# EAGLE design 5i20-xylotex-d (EAGLE 5.06)
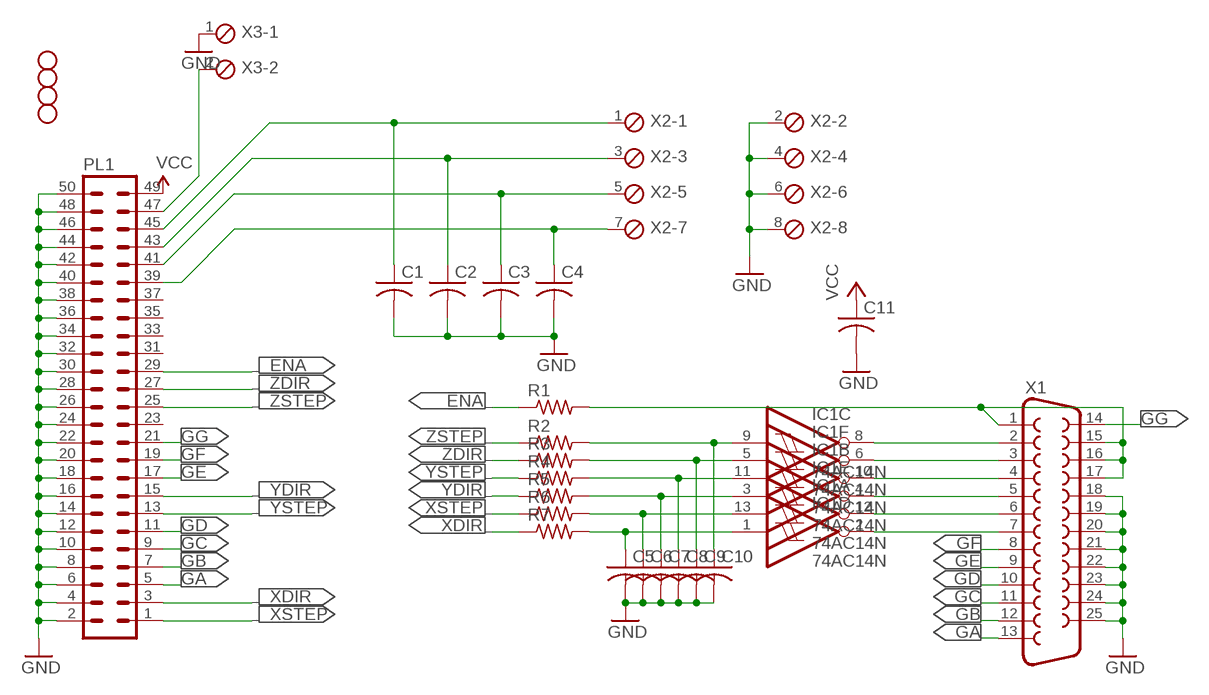
[diagram p0: schematic, sheet 1]

## Parts
C1  C-US025-025X050  [C025-025X050]
C2  C-US025-025X050  [C025-025X050]
C3  C-US025-025X050  [C025-025X050]
C4  C-US025-025X050  [C025-025X050]
C5  C-US025-024X044  [C025-024X044]
C6  C-US025-024X044  [C025-024X044]
C7  C-US025-024X044  [C025-024X044]
C8  C-US025-024X044  [C025-024X044]
C9  C-US025-024X044  [C025-024X044]
C10  C-US025-024X044  [C025-024X044]
C11  C-US025-024X044  [C025-024X044]
IC1  74AC14N  [DIL14]
PL1  50V  [50V]
R1  R-US_0204/2V  [0204V]
R2  R-US_0204/2V  [0204V]
R3  R-US_0204/2V  [0204V]
R4  R-US_0204/2V  [0204V]
R5  R-US_0204/2V  [0204V]
R6  R-US_0204/2V  [0204V]
R7  R-US_0204/2V  [0204V]
U$1  STAND-OFF  [STAND-OFF]
U$2  STAND-OFF  [STAND-OFF]
U$3  STAND-OFF  [STAND-OFF]
U$4  STAND-OFF  [STAND-OFF]
X1  F25HP  [F25HP]
X2  MPT8  [8POL254]
X3  MPT2  [2POL254]

## Nets
ENA: PL1.29 R1.1 R1.2 X1.1 X1.15 X1.16 X1.17
GA: PL1.5 X1.13
GB: PL1.7 X1.12
GC: PL1.9 X1.11
GD: PL1.11 X1.10
GE: PL1.17 X1.9
GF: PL1.19 X1.8
GG: PL1.21 X1.14
GND [pwr]: C1.2 C2.2 C3.2 C4.2 C5.2 C6.2 C7.2 C8.2 C9.2 C10.2 C11.2 PL1.2 PL1.4 PL1.6 PL1.8 PL1.10 PL1.12 PL1.14 PL1.16 PL1.18 PL1.20 PL1.22 PL1.24 PL1.26 PL1.28 PL1.30 PL1.32 PL1.34 PL1.36 PL1.38 PL1.40 PL1.42 PL1.44 PL1.46 PL1.48 PL1.50 X1.18 X1.19 X1.20 X1.21 X1.22 X1.23 X1.24 X1.25 X2.2 X2.4 X2.6 X2.8 X3.1
N$2: IC1.2(D:O) X1.7
N$3: IC1.12(A:O) X1.6
N$4: IC1.4(E:O) X1.5
N$6: IC1.10(B:O) X1.4
N$7: IC1.6(F:O) X1.3
N$8: IC1.8(C:O) X1.2
N$11: PL1.47 X3.2
TSW: C1.1 PL1.45 X2.1
VCC: C11.1 PL1.49
XDIR: PL1.3 R7.1
XDIRF: C5.1 IC1.1(D:I) R7.2
XSTEP: PL1.1 R6.1
XSTEPF: C6.1 IC1.13(A:I) R6.2
XSW: C4.1 PL1.39 X2.7
YDIR: PL1.15 R5.1
YDIRF: C7.1 IC1.3(E:I) R5.2
YSTEP: PL1.13 R4.1
YSTEPF: C8.1 IC1.11(B:I) R4.2
YSW: C3.1 PL1.41 X2.5
ZDIR: PL1.27 R3.1
ZDIRF: C9.1 IC1.5(F:I) R3.2
ZSTEP: PL1.25 R2.1
ZSTEPF: C10.1 IC1.9(C:I) R2.2
ZSW: C2.1 PL1.43 X2.3
Unconnected: PL1.23 PL1.31 PL1.33 PL1.35 PL1.37

## Power pins joined to a net without a drawn wire
GND: IC1.7(P:GND)
VCC: IC1.14(P:VCC)

## Library data of the parts
C1-C11 = rcl:C-US: CAPACITOR, American symbol
IC1 = 74xx-eu:74*14: Hex schmitt trigger INVERTER
PL1 = con-harting-v:50V: CONNECTOR
R1-R7 = rcl:R-US_: RESISTOR, American symbol
U$1-U$4 = SparkFun:STAND-OFF: Stand Off This is the mechanical footprint for a #4 phillips button head screw. Use the keepout ring to avoid running the screw head into surrounding components. SKU : PRT-00447
X1 = SparkFun:F25: D-SUB 25 25 Pin male connector. PCB edge mount for regular PCB thicknesses. This connector will connect directly to the back of a PC parallel port or through a normal DB25 extension cable (M/F). SKU: PRT-08287
X2 = con-phoenix-254:MPT8: PHOENIX CONNECTOR
X3 = con-phoenix-254:MPT2: PHOENIX CONNECTOR

## Net classes
0 default: width 0.356 mm, clearance 0.33 mm
1 pwr: width 0.635 mm

## Board
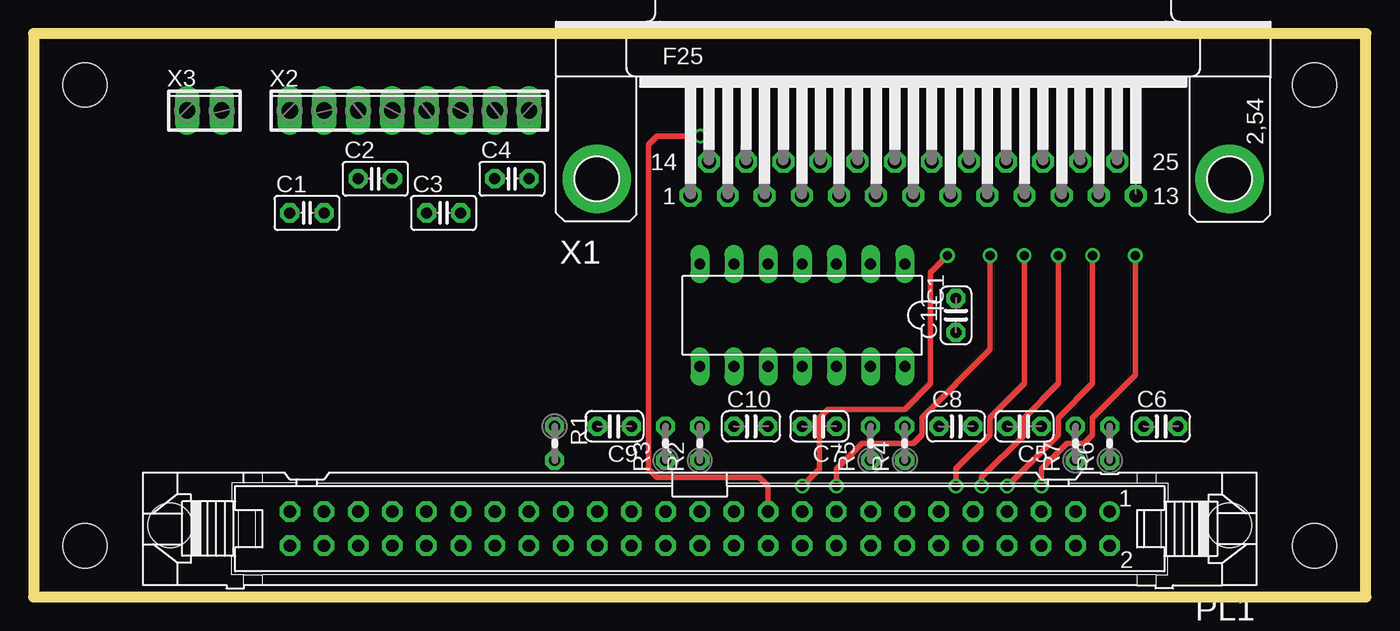
[diagram p1: board, top side]
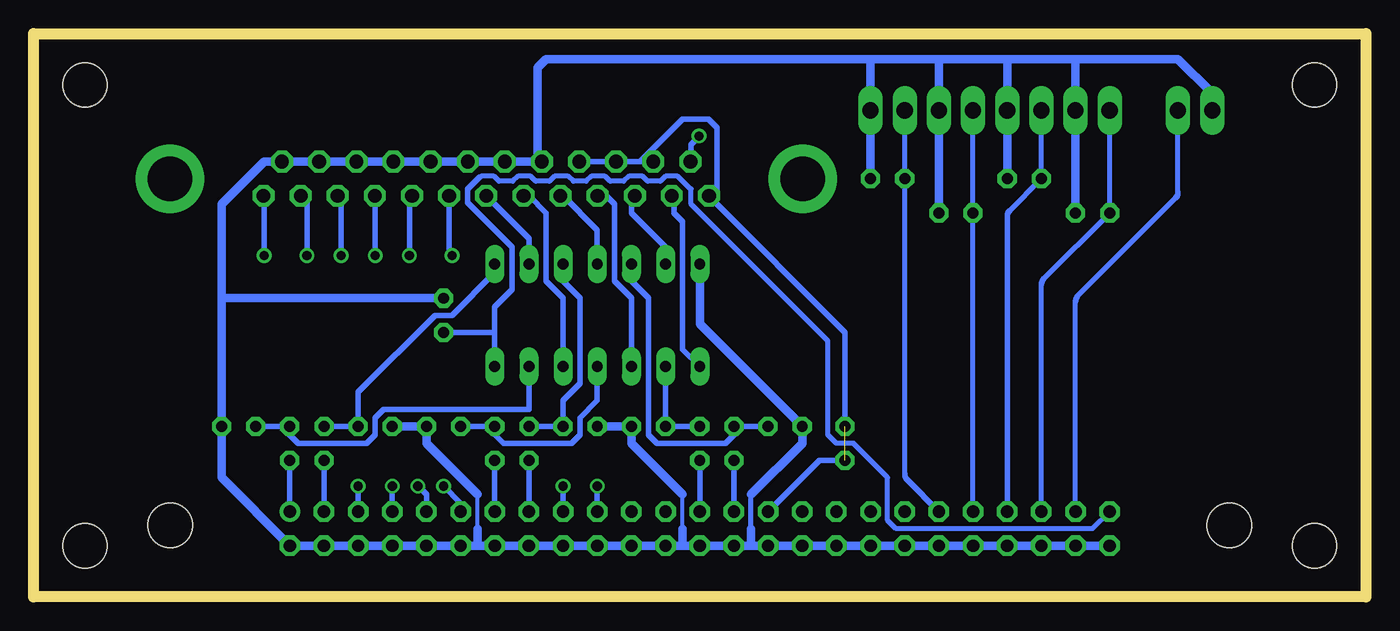
[diagram p2: board, bottom side, seen from below]

Size 99.06 x 41.91 mm. Coordinates in mm from the lower left corner, seen from the top.
Outline: 0,0 99.06,0 99.06,41.91 0,41.91 0,0
Copper layers (1*16): Top 0.035mm / dielectric 1.5mm / Bottom 0.035mm
Design rules "default *": minimum track width 10mil, minimum drill 27mil, track to track 8mil, track to pad 8mil, pad to pad 8mil, via to via 8mil, smd to smd 8mil, copper to edge 4mil, drill to drill 8mil, minimum pad ring 12mil, minimum via ring 8mil, stop-mask expansion 4mil, vias tented up to drill 0mil, thermal gap 10mil

### Footprints (pad centres in the part's own frame; a part is rotated, then mirrored left to right if it is on the bottom)
C025-025X050 = drill 0.813 octagon: 1 -1.27,0; 2 1.27,0
C025-024X044 = drill 0.813 octagon: 1 -1.27,0; 2 1.27,0
DIL14 = drill 0.813 long: 1 -7.62,-3.81; 2 -5.08,-3.81; 3 -2.54,-3.81; 4 0,-3.81; 5 2.54,-3.81; 6 5.08,-3.81; 7 7.62,-3.81; 8 7.62,3.81; 9 5.08,3.81; 10 2.54,3.81; 11 0,3.81; 12 -2.54,3.81; 13 -5.08,3.81; 14 -7.62,3.81
50V = drill 0.914 round: 1 -30.48,-1.27 | drill 0.914 octagon: 2 -30.48,1.27; 3 -27.94,-1.27; 4 -27.94,1.27; 5 -25.4,-1.27; 6 -25.4,1.27; 7 -22.86,-1.27; 8 -22.86,1.27; 9 -20.32,-1.27; 10 -20.32,1.27; 11 -17.78,-1.27; 12 -17.78,1.27; 13 -15.24,-1.27; 14 -15.24,1.27; 15 -12.7,-1.27; 16 -12.7,1.27; 17 -10.16,-1.27; 18 -10.16,1.27; 19 -7.62,-1.27; 20 -7.62,1.27; 21 -5.08,-1.27; 22 -5.08,1.27; 23 -2.54,-1.27; 24 -2.54,1.27; 25 0,-1.27; 26 0,1.27; 27 2.54,-1.27; 28 2.54,1.27; 29 5.08,-1.27; 30 5.08,1.27; 31 7.62,-1.27; 32 7.62,1.27; 33 10.16,-1.27; 34 10.16,1.27; 35 12.7,-1.27; 36 12.7,1.27; 37 15.24,-1.27; 38 15.24,1.27; 39 17.78,-1.27; 40 17.78,1.27; 41 20.32,-1.27; 42 20.32,1.27; 43 22.86,-1.27; 44 22.86,1.27; 45 25.4,-1.27; 46 25.4,1.27; 47 27.94,-1.27; 48 27.94,1.27; 49 30.48,-1.27; 50 30.48,1.27 | hole 3.302: 39.37,-0.254; -39.37,-0.254
0204V = drill 0.813 octagon: 1 -1.27,0; 2 1.27,0
STAND-OFF = hole 3.302: 0,0
F25HP = drill 1.016 octagon: 1 -16.561,-1.27; 2 -13.792,-1.27; 3 -11.049,-1.27; 4 -8.28,-1.27; 5 -5.512,-1.27; 6 -2.769,-1.27; 7 0,-1.27; 8 2.769,-1.27; 9 5.512,-1.27; 10 8.28,-1.27; 11 11.049,-1.27; 12 13.792,-1.27; 13 16.561,-1.27; 14 -15.189,1.27; 15 -12.421,1.27; 16 -9.652,1.27; 17 -6.909,1.27; 18 -4.14,1.27; 19 -1.372,1.27; 20 1.372,1.27; 21 4.14,1.27; 22 6.909,1.27; 23 9.652,1.27; 24 12.421,1.27; 25 15.189,1.27 | drill 3.302 pad 5.08 round: G1 -23.52,0; G2 23.52,0
8POL254 = drill 1.2 long: 1 -8.89,0; 2 -6.35,0; 3 -3.81,0; 4 -1.27,0; 5 1.27,0; 6 3.81,0; 7 6.35,0; 8 8.89,0
2POL254 = drill 1.2 long: 1 -1.27,0; 2 1.27,0

### Placement (x,y rotation side)
C1  20.32,28.57 0 top
C2  25.4,31.11 0 top
C3  30.48,28.57 0 top
C4  35.56,31.11 0 top
C5  73.66,12.7 180 top
C6  83.82,12.7 0 top
C7  58.42,12.7 180 top
C8  68.58,12.7 0 top
C9  43.18,12.7 180 top
C10  53.34,12.7 0 top
C11  68.58,20.95 90 top
IC1  57.15,20.95 180 top
PL1  49.53,5.08 180 top
R1  38.73,11.43 270 top
R2  49.53,11.43 90 top
R3  46.99,11.43 90 top
R4  64.77,11.43 90 top
R5  62.23,11.43 90 top
R6  80.01,11.43 90 top
R7  77.47,11.43 90 top
U$1  3.81,3.81 0 top
U$2  3.81,38.1 0 top
U$3  95.25,38.1 0 top
U$4  95.25,3.81 0 top
X1  65.41,31.11 0 top
X2  27.94,36.2 0 top
X3  12.7,36.2 0 top

### Tracks (layer width: path | path; a pad name or v marks a point on that pad's centre or on a via)
ENA  (1 unrouted)
  Bottom 0.406: R1.2 40.64,10.16 PL1.29 | 53.98,32.38 X1.15 | 53.98,32.38 X1.16 X1.17 | 53.98,32.38 50.8,35.56 48.9,35.56 48.26,34.92 48.26,29.84 X1.1 48.9,29.84 38.73,19.68 R1.1
GA  (via drill 0.69)
  Top 0.406: v74.93,8.26 74.93,9.53 76.83,11.43 78.11,11.43 78.74,12.06 78.74,13.34 81.92,16.51 v81.92,25.4
  Bottom 0.406: PL1.5 v74.93,8.26 | X1.13 81.92,29.84 v81.92,25.4
GB  (via drill 0.69)
  Top 0.406: v78.74,25.4 78.74,15.88 76.2,13.34 76.2,12.06 v72.39,8.26
  Bottom 0.406: PL1.7 v72.39,8.26 | v78.74,25.4 78.74,29.39 X1.12
GC  (via drill 0.69)
  Top 0.406: v76.2,25.4 76.2,15.88 73.66,13.34 73.66,12.06 70.48,8.89 v70.48,8.26
  Bottom 0.406: X1.11 76.2,29.84 v76.2,25.4 | PL1.9 69.85,7.62 v70.48,8.26
GD  (via drill 0.69)
  Top 0.406: v73.66,25.4 73.66,15.88 71.12,13.34 71.12,12.06 68.58,9.53 v68.58,8.26
  Bottom 0.406: X1.10 73.69,25.43 v73.66,25.4 | v68.58,8.26 67.31,6.99 PL1.11
GE  (via drill 0.69)
  Top 0.406: v71.12,25.4 71.12,18.41 66.04,13.34 66.04,12.06 65.41,11.43 61.59,11.43 59.69,9.53 v59.69,8.26
  Bottom 0.406: X1.9 71.12,29.84 v71.12,25.4 | PL1.17 v59.69,8.26
GF  (via drill 0.69)
  Top 0.406: v67.94,25.4 66.67,24.13 66.67,15.88 64.77,13.97 59.05,13.97 58.42,13.34 58.42,9.53 v57.15,8.26
  Bottom 0.406: X1.8 68.17,25.63 v67.94,25.4 | PL1.19 v57.15,8.26
GG  (via drill 0.69)
  Top 0.406: PL1.21 54.61,8.26 53.98,8.89 46.35,8.89 45.72,9.53 45.72,33.66 46.35,34.29 v49.58,34.29
  Bottom 0.406: v49.58,34.29 49.58,34.24 50.16,33.66 X1.14
GND
  Bottom 0.305: 66.04,5.08 66.04,7.62 | 50.8,5.08 50.8,7.62
  Bottom 0.356: 45.72,5.08 45.72,7.62
  Bottom 0.635: 66.04,3.81 66.04,5.08 | 66.04,3.81 PL1.14 PL1.16 PL1.18 PL1.20 PL1.22 PL1.24 50.8,3.81 | 50.8,3.81 50.8,5.08 | 66.04,3.81 PL1.12 PL1.10 PL1.8 PL1.6 PL1.4 PL1.2 85.09,8.89 C6.2 85.09,22.23 | 50.8,3.81 PL1.26 PL1.28 45.72,3.81 | C3.2 X2.6 31.75,40.01 | C4.2 X2.8 36.83,40.01 | C1.2 X2.2 21.59,40.01 | C2.2 X2.4 26.67,40.01 | 26.67,40.01 21.59,40.01 | 31.75,40.01 26.67,40.01 | PL1.50 PL1.48 PL1.46 PL1.44 PL1.42 PL1.40 PL1.38 PL1.36 PL1.34 PL1.32 PL1.30 45.72,3.81 | 36.83,40.01 31.75,40.01 | 61.59,32.38 X1.19 X1.20 X1.21 X1.22 X1.23 X1.24 X1.25 81.92,32.38 85.09,29.21 85.09,22.23 | 61.59,32.38 X1.18 | C5.2 C8.2 69.85,11.43 66.04,7.62 | 50.8,7.62 54.61,11.43 C10.2 C7.2 | 45.72,3.81 45.72,5.08 | 45.72,7.62 41.91,11.43 C9.2 49.53,20.32 IC1.7 | 36.83,40.01 60.96,40.01 61.59,39.37 61.59,32.38 | 85.09,22.23 C11.2 | X3.1 11.43,37.47 13.97,40.01 21.59,40.01
N$2
  Bottom 0.406: IC1.2 62.23,26.67 X1.7
N$3
  Bottom 0.406: IC1.12 59.69,22.23 60.96,23.5 60.96,28.57 62.23,29.84 X1.6
N$4
  Bottom 0.406: IC1.4 57.15,27.3 59.69,29.84 X1.5
N$6
  Bottom 0.406: X1.4 56.52,29.84 55.88,29.21 55.88,23.5 54.61,22.23 IC1.10
N$7
  Bottom 0.406: IC1.6 52.07,26.04 54.61,28.57 54.61,29.84 X1.3
N$8
  Bottom 0.406: IC1.8 50.8,18.41 50.8,27.94 51.44,28.57 51.44,29.84 X1.2
N$11
  Bottom 0.356: PL1.47 21.59,21.96 | 21.4,22.41 14.16,29.66 | 13.97,30.11 X3.2
  Bottom 0.406: 21.59,21.96 arc45 21.4,22.41 | 14.16,29.66 arc-45 13.97,30.11
TSW
  Bottom 0.356: X2.1 C1.1 23.94,23.68 | PL1.45 24.13,23.23
  Bottom 0.406: 24.13,23.23 arc45 23.94,23.68
VCC
  Bottom 0.356: PL1.49 20.32,5.08 34.92,5.08 35.56,5.71 35.56,8.89 38.1,11.43 39.37,11.43 40.01,12.06 40.01,19.05 50.16,29.21 50.16,30.35 50.29,30.42 51.18,31.3 52.07,31.3 52.45,30.92 53.4,30.92 53.78,31.3 54.8,31.3 55.18,30.92 56.2,30.92 56.58,31.3 57.59,31.3 57.98,30.92 58.93,30.92 59.31,31.3 60.33,31.3 60.71,30.92 61.72,30.92 62.1,31.3 63.06,31.3 63.44,30.92 64.45,30.92 64.83,31.3 65.79,31.3 65.91,31.24
  Bottom 0.406: 65.91,31.24 66.8,30.35 66.8,29.34 63.5,26.04 63.5,22.86 64.77,21.59 64.77,19.68 | 64.77,19.68 IC1.14 | 64.77,19.68 C11.1
XDIR
  Bottom 0.406: PL1.3 R7.1
XDIRF
  Bottom 0.406: IC1.1 64.77,24.13 67.94,20.95 69.22,20.95 74.93,15.24 C5.1 R7.2
XSTEP
  Bottom 0.406: PL1.1 R6.1
XSTEPF
  Bottom 0.406: 80.64,12.7 C6.1 | 80.64,12.7 79.38,11.43 74.3,11.43 73.66,12.06 73.66,13.34 73.03,13.97 62.23,13.97 IC1.13 | 80.64,12.7 R6.2
XSW
  Bottom 0.356: X2.7 C4.1 34.29,9.15
  Bottom 0.406: PL1.39 34.1,8.7 arc45 34.29,9.15
YDIR
  Bottom 0.406: PL1.15 R5.1
YDIRF
  Bottom 0.406: IC1.3 59.69,23.5 58.42,22.23 58.42,15.88 59.69,14.61 C7.1 R5.2
YSTEP
  Bottom 0.406: PL1.13 R4.1
YSTEPF
  Bottom 0.406: 65.41,12.7 C8.1 | 65.41,12.7 64.14,11.43 59.05,11.43 58.42,12.06 58.42,13.34 57.15,14.61 IC1.11 | 65.41,12.7 R4.2
YSW
  Bottom 0.356: X2.5 C3.1 PL1.41
ZDIR
  Bottom 0.406: PL1.27 R3.1
ZDIRF
  Bottom 0.406: C9.1 46.35,12.7 | IC1.5 54.61,23.5 53.34,22.23 53.34,12.06 52.7,11.43 47.62,11.43 46.35,12.7 | 46.35,12.7 R3.2
ZSTEP
  Bottom 0.406: PL1.25 R2.1
ZSTEPF
  Bottom 0.406: R2.2 C10.1 IC1.9
ZSW
  Bottom 0.356: X2.3 C2.1 26.48,28.76
  Bottom 0.406: PL1.43 26.67,28.31 arc45 26.48,28.76